# Altium schematic sheet KR1.SchDoc
size A4; SheetNumber: 1; SheetTotal: 4
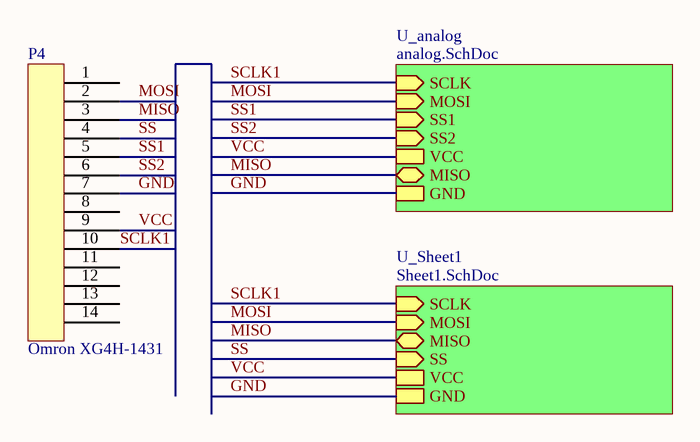
[diagram p0: KR1.SchDoc]

## Parts
P4  Omron XG4H-1431  [PCB-ufmg19m1jja1hi8pwkok-1]

## Sub-sheets
U_analog = analog.SchDoc: SCLK (in), MOSI (in), SS1 (in), SS2 (in), VCC, MISO (bidir), GND
U_Sheet1 = Sheet1.SchDoc: SCLK (in), MOSI (in), MISO (bidir), SS (in), VCC, GND

## Nets
GND: P4.7 ; sheet U_analog/GND, sheet U_Sheet1/GND
MISO: P4.3 ; sheet U_analog/MISO, sheet U_Sheet1/MISO
MOSI: P4.2 ; sheet U_analog/MOSI, sheet U_Sheet1/MOSI
SCLK1: P4.10 ; sheet U_analog/SCLK, sheet U_Sheet1/SCLK
SS: P4.4 ; sheet U_Sheet1/SS
SS1: P4.5 ; sheet U_analog/SS1
SS2: P4.6 ; sheet U_analog/SS2
VCC: P4.9 ; sheet U_analog/VCC, sheet U_Sheet1/VCC

Not connected (* = marked no-connect by the designer): P4 1 8 11 12 13 14

## Library data of the parts
P4 = CMP-754fbc3c8639aa88-2: Conn Socket Strip SKT 14 POS 2.54mm Solder ST Thru-Hole; Manufacturer Part Number: XG4H-1431; Mounting Style: Through Hole; OctopartID: 754fbc3c8639aa88; RoHS: Compliant; Octopart URL: https://octopart.com/xg4h-1431-omron-7984656; Packaging: Bulk; Color: Black